# EAGLE design dhunter_bike_texted (EAGLE 6.4)
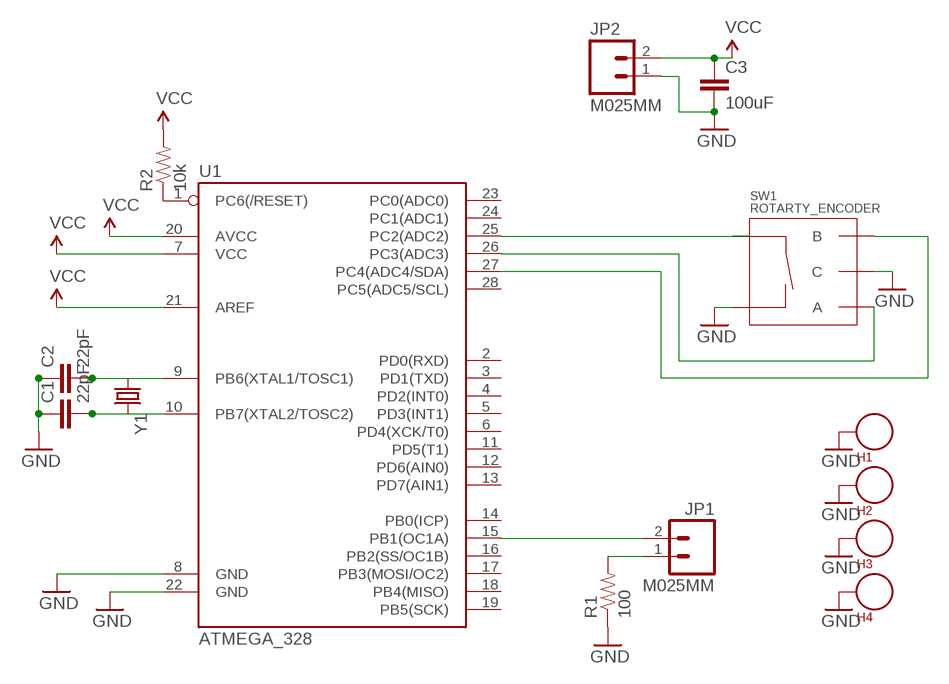
[diagram p0: schematic, sheet 1]

## Parts
C1  22pF  CAPEZ  [CAP-PTH-SMALLEZ]
C2  22pF  CAPEZ  [CAP-PTH-SMALLEZ]
C3  100uF  CAPEZ  [CAP-PTH-SMALLEZ]
H1  SEW_HOLE  [SIMPLE_HOLE]
H2  SEW_HOLE  [SIMPLE_HOLE]
H3  SEW_HOLE  [SIMPLE_HOLE]
H4  SEW_HOLE  [SIMPLE_HOLE]
JP1  M025MM  [SCREWTERMINAL-5MM-2]
JP2  M025MM  [SCREWTERMINAL-5MM-2]
R1  100  RESISTOREZ  [AXIAL-0.3EZ]
R2  10k  RESISTOREZ  [AXIAL-0.3EZ]
SW1  ROTARTY_ENCODER  [ROTARY_ENC_PLAIN]
U1  ATMEGA_328  ATMEGA328P_PDIP  [DIL28-3]
Y1  CRYSTALHC49US  [HC49US]

## Nets
GND: C1.1 C2.1 C3.2 H1.P$1 H2.P$1 H3.P$1 H4.P$1 JP2.1 R1.P$1 SW1.C SW1.SW- U1.8(GND) U1.22(GND)
N$2: SW1.SW+ U1.25(PC2(ADC2))
N$5: C1.2 U1.10(PB7(XTAL2/TOSC2)) Y1.2
N$6: C2.2 U1.9(PB6(XTAL1/TOSC1)) Y1.1
N$7: JP1.2 U1.15(PB1(OC1A))
N$8: JP1.1 R1.P$2
N$9: R2.P$1 U1.1(PC6(/RESET))
ROTA: SW1.A U1.26(PC3(ADC3))
ROTB: SW1.B U1.27(PC4(ADC4/SDA))
VCC: C3.1 JP2.2 R2.P$2 U1.7(VCC) U1.20(AVCC) U1.21(AREF)
Unconnected: U1.2(PD0(RXD)) U1.3(PD1(TXD)) U1.4(PD2(INT0)) U1.5(PD3(INT1)) U1.6(PD4(XCK/T0)) U1.11(PD5(T1)) U1.12(PD6(AIN0)) U1.13(PD7(AIN1)) U1.14(PB0(ICP)) U1.16(PB2(SS/OC1B)) U1.17(PB3(MOSI/OC2)) U1.18(PB4(MISO)) U1.19(PB5(SCK)) U1.23(PC0(ADC0)) U1.24(PC1(ADC1)) U1.28(PC5(ADC5/SCL))

## Library data of the parts
C1-C3 = SparkFun-Capacitors:CAP: Capacitor Standard 0603 ceramic capacitor, and 0.1" leaded capacitor.
H1-H4 = LilyPad-Wearables:SEW_HOLE: Simple sew-hole .1" diameter hole with 20mil annular ring
JP1 JP2 = SparkFun-Connectors:M02: Standard 2-pin 0.1" header. Use with - straight break away headers ( PRT-00116) - right angle break away headers (PRT-00553) - swiss pins (PRT-00743) - machine pins (PRT-00117) - female headers (PRT-00115) Molex polarized connector foot print use with: PRT-08233 with associated crimp pins and housings. 2.54_SCREWTERM for use with PRT-10571. 3.5mm Screw Terminal footprints for PRT-08084 5mm Screw Terminal footprints for use with PRT-08433
R1 R2 = SparkFun-Passives:RESISTOR: Resistor Basic schematic elements and footprints for 0603, 1206, and PTH resistors.
SW1 = SparkFun-Electromechanical:ROTARTY_ENCODER: Simple no LED rotary encoder Example: COM-09117
U1 = SparkFun-DigitalIC:ATMEGA328P_PDIP: uC used in the Arduino 32kb flash, 1k EEPROM, 2k SRAM This is the through-hole version of this chip.
Y1 = SparkFun-FreqCtrl:CRYSTAL: Various standard crystals. Proven footprints. Spark Fun Electronics SKU : COM-00534

## Board
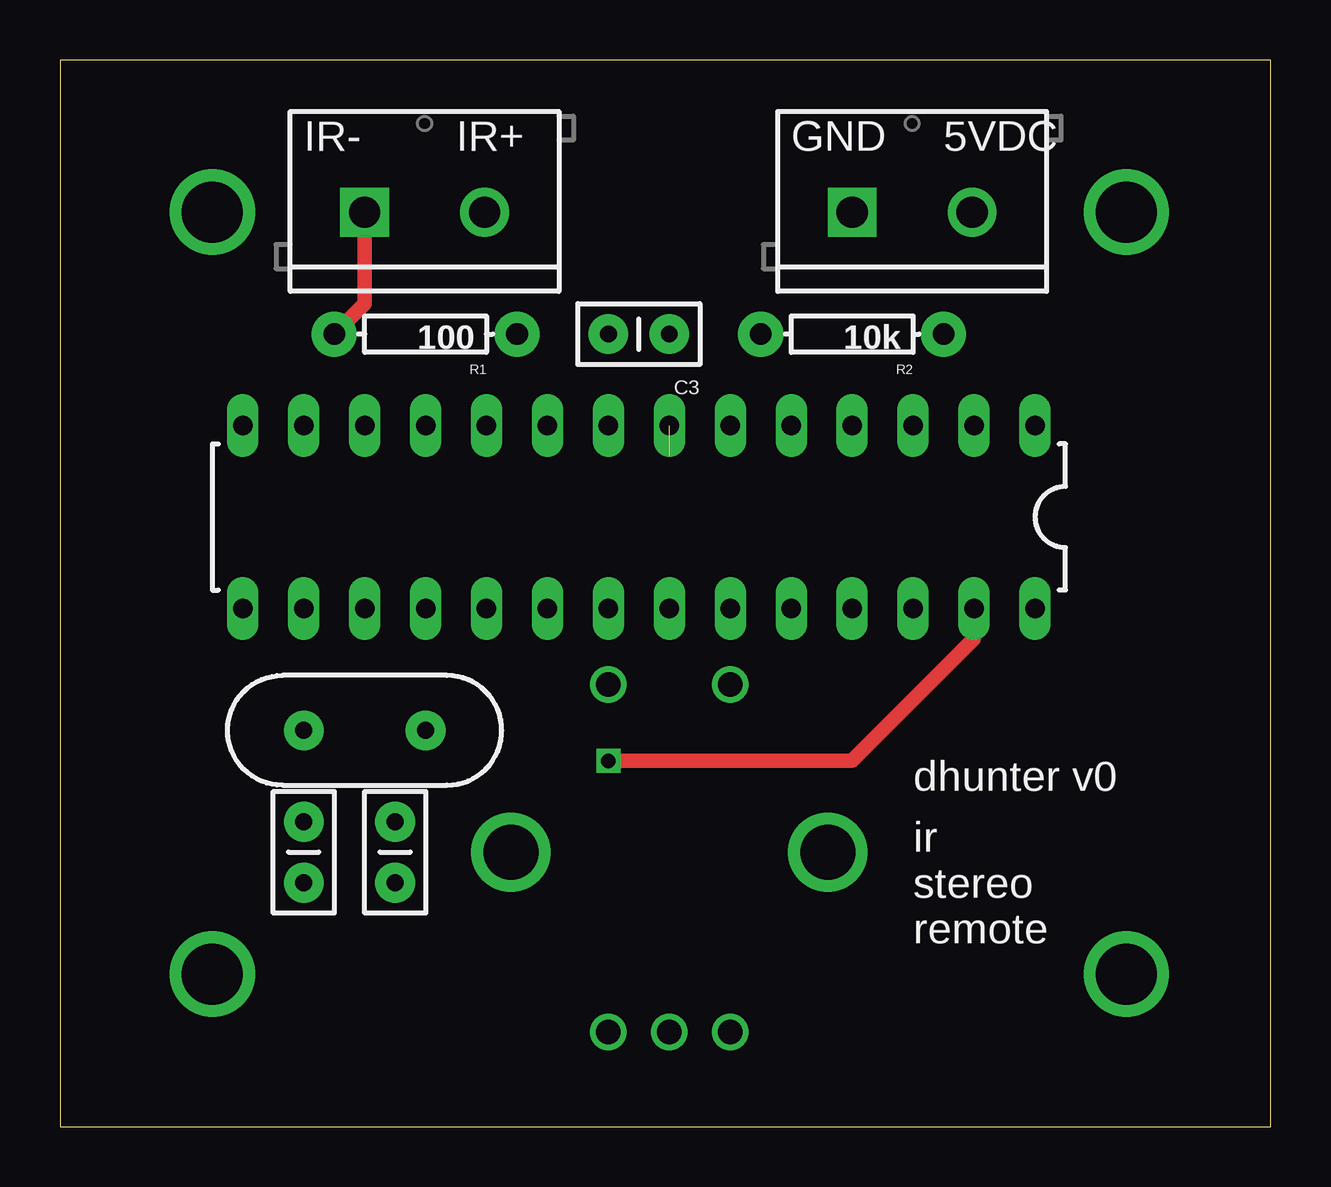
[diagram p1: board, top side]
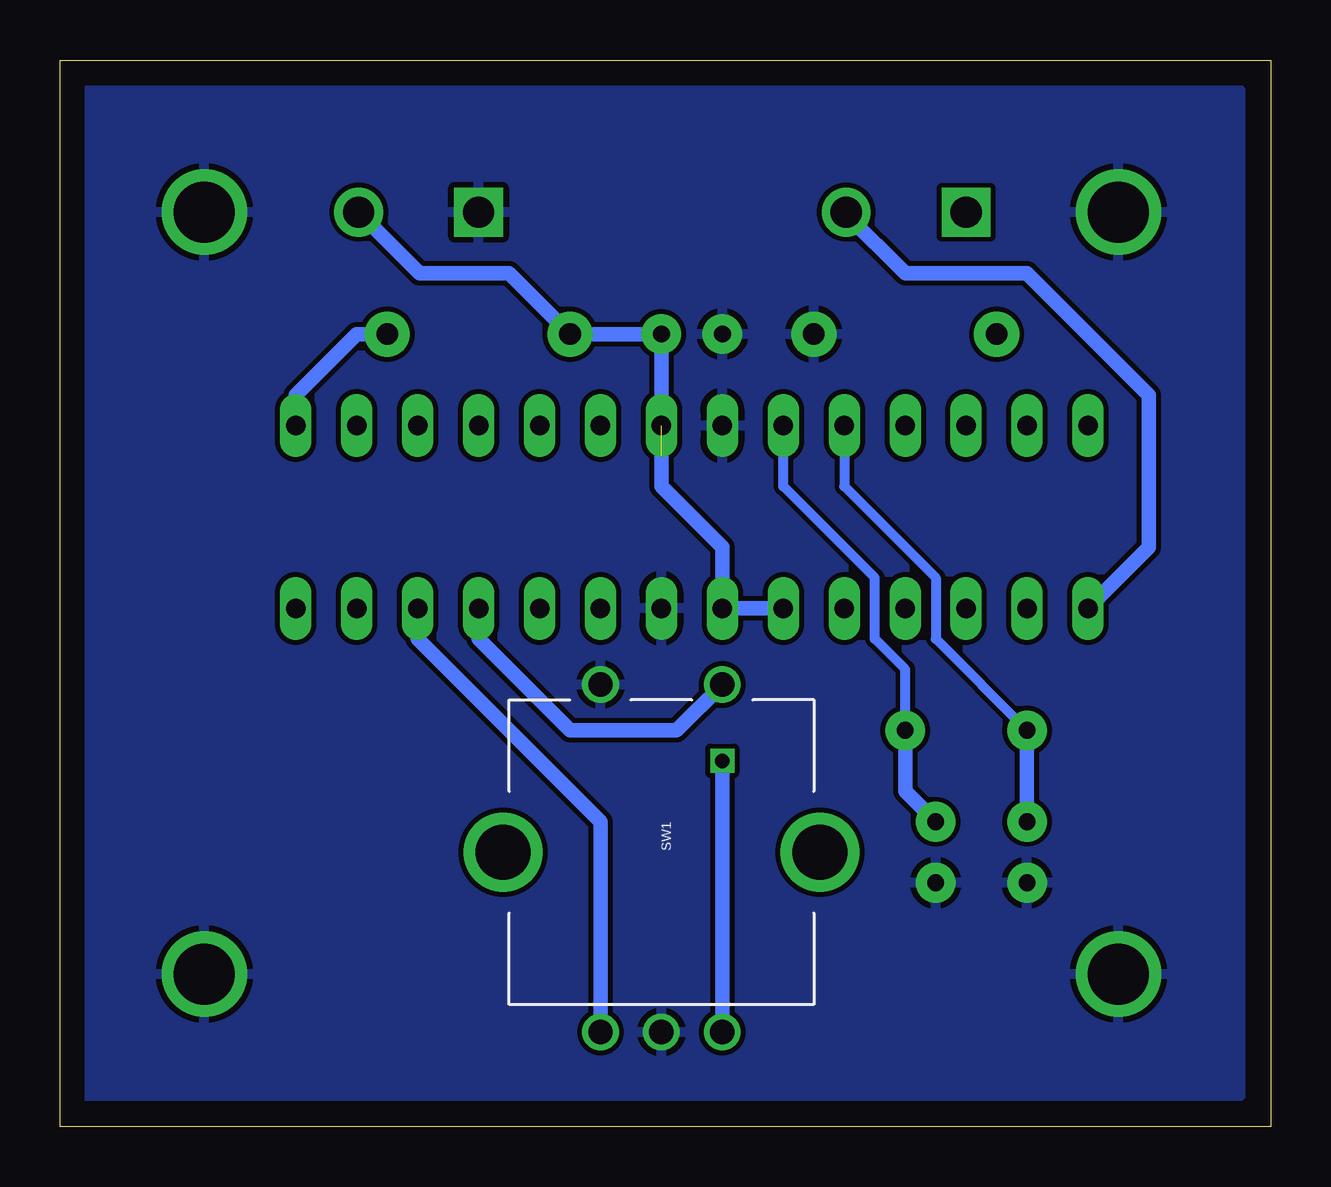
[diagram p2: board, bottom side, seen from below]

Size 50.47 x 44.44 mm. Coordinates in mm from the lower left corner, seen from the top.
Outline: 0,0 50.47,0 50.47,44.44 0,44.44 0,0
Copper layers (1*16): Top 0.035mm / dielectric 1.5mm / Bottom 0.035mm
Design rules "default": minimum track width 10mil, minimum drill 24mil, track to track 8mil, track to pad 8mil, pad to pad 8mil, via to via 8mil, smd to smd 8mil, copper to edge 40mil, drill to drill 8mil, minimum pad ring 10mil, minimum via ring 8mil, stop-mask expansion 4mil, vias tented up to drill 0mil, thermal gap 10mil

### Footprints (pad centres in the part's own frame; a part is rotated, then mirrored left to right if it is on the bottom)
CAP-PTH-SMALLEZ = drill 0.7 pad 1.651: 1 0,0; 2 2.54,0
SIMPLE_HOLE = drill 2.54 pad 3.048: P$1 0,0
SCREWTERMINAL-5MM-2 = drill 1.3 pad 2.032 square: 1 0,0 | drill 1.3 pad 2.032: 2 5,0
AXIAL-0.3EZ = drill 0.9 pad 1.88: P$1 -3.81,0; P$2 3.81,0
ROTARY_ENC_PLAIN = drill 1.016: A 7.493,-2.54; B 7.493,2.54; C 7.493,0; SW+ -6.985,2.54; SW- -6.985,-2.54 | drill 2.286: P$3 0,6.604; P$4 0,-6.604
DIL28-3 = drill 0.813 long: 1 -16.51,-3.81; 2 -13.97,-3.81; 3 -11.43,-3.81; 4 -8.89,-3.81; 5 -6.35,-3.81; 6 -3.81,-3.81; 7 -1.27,-3.81; 8 1.27,-3.81; 9 3.81,-3.81; 10 6.35,-3.81; 11 8.89,-3.81; 12 11.43,-3.81; 13 13.97,-3.81; 14 16.51,-3.81; 15 16.51,3.81; 16 13.97,3.81; 17 11.43,3.81; 18 8.89,3.81; 19 6.35,3.81; 20 3.81,3.81; 21 1.27,3.81; 22 -1.27,3.81; 23 -3.81,3.81; 24 -6.35,3.81; 25 -8.89,3.81; 26 -11.43,3.81; 27 -13.97,3.81; 28 -16.51,3.81
HC49US = drill 0.7 pad 1.651: 1 -2.54,0; 2 2.54,0

### Placement (x,y rotation side)
C1  10.16,10.16 90 top
C2  13.97,10.16 90 top
C3  25.4,33.02 180 top
H1  6.35,6.35 0 top
H2  6.35,38.1 0 top
H3  44.45,6.35 0 top
H4  44.45,38.1 0 top
JP1  12.7,38.1 0 top
JP2  33.02,38.1 0 top
R1  15.24,33.02 180 top
R2  33.02,33.02 180 top
SW1  25.4,11.43 270 bottom
U1  24.13,25.4 180 top
Y1  12.7,16.51 180 top

### Tracks (layer width: path | path; a pad name or v marks a point on that pad's centre or on a via)
GND
  pour Bottom: 1.27,43.18 1.27,1.27 49.53,1.27 49.53,43.18
N$2
  Bottom 0.61: U1.25 33.02,20.32 29.21,16.51 24.77,16.51 SW1.SW+
N$5
  Bottom 0.406: U1.10 17.78,26.67 13.97,22.86 13.97,20.32 Y1.2
  Bottom 0.61: C1.2 Y1.2
N$6
  Bottom 0.406: Y1.1 15.24,19.05 16.51,20.32 16.51,22.86 20.32,26.67 U1.9
  Bottom 0.61: C2.2 15.24,13.97 Y1.1
N$7
  Bottom 0.61: U1.15 5.08,24.13 5.08,30.48 10.16,35.56 15.24,35.56 17.7,38.02 JP1.2
N$8
  Top 0.61: JP1.1 12.7,34.29 R1.P$2
N$9
  Bottom 0.61: R2.P$1 38.1,33.02 40.64,30.48 U1.1
ROTA
  Bottom 0.61: SW1.A 27.94,12.7 35.56,20.32 U1.26
ROTB  (via drill 0.6)
  Top 0.61: v22.86,15.24 33.02,15.24 38.1,20.32 U1.27
  Bottom 0.61: SW1.B v22.86,15.24
VCC  (1 unrouted)
  Bottom 0.61: JP2.2 35.48,35.56 31.75,35.56 R2.P$2 C3.1 U1.7 | U1.7 25.4,27.94 | U1.7 25.4,26.67 22.86,24.13 U1.21 U1.20

### Text on the board
tNames: IR- | IR+ | GND | 5VDC | dhunter v0 | ir / stereo / remote